# Altium schematic sheet YakupTrkn1.SchDoc
size A4
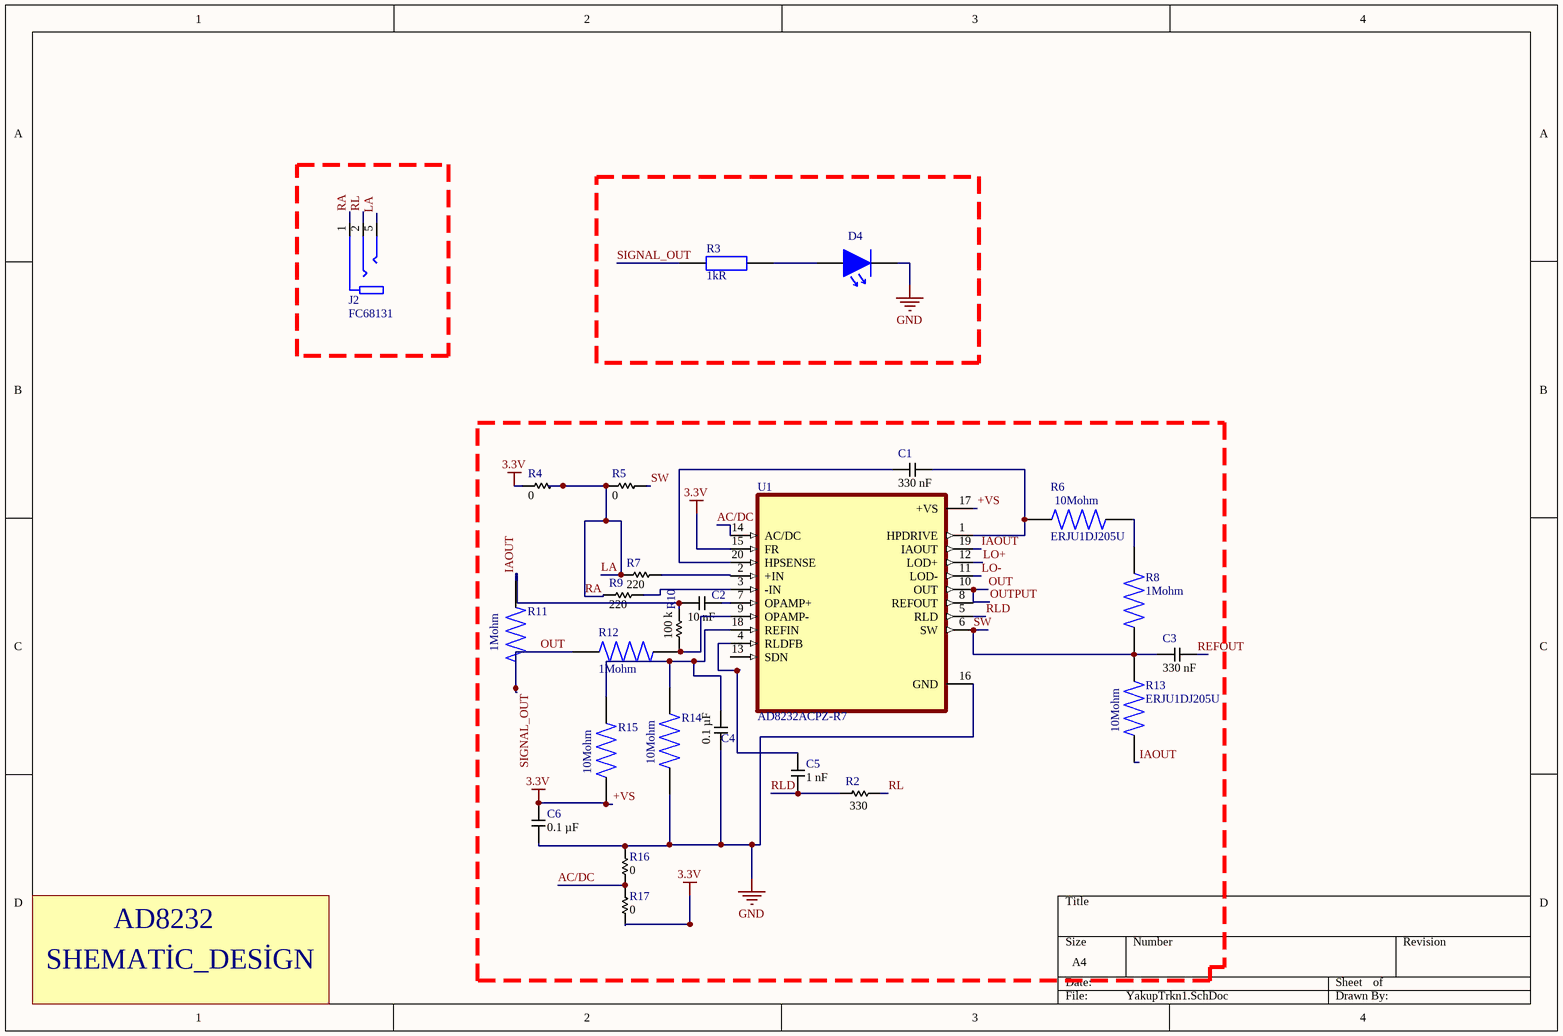
[diagram p0: YakupTrkn1.SchDoc]

## Parts
C1  Capacitance: 330 nF  [SAMSUNG_CAP_0805_095]  (hidden comment: CL21B334KOCNNNC)
C2  Capacitance: 10 nF  [SAMSUNG_CAP_0603_090]  (hidden comment: CL10B103KB8NNNL)
C3  Capacitance: 330 nF  [SAMSUNG_CAP_0805_095]  (hidden comment: CL21B334KOCNNNC)
C4  Capacitance: 0.1 µF  [SAMSUNG_CAP_0805_095]  (hidden comment: CL21B104MACNNNC)
C5  Capacitance: 1 nF  [SAMSUNG_CAP_0805_095]  (hidden comment: CL21B102KBCNNNC)
C6  Capacitance: 0.1 µF  [SAMSUNG_CAP_0805_095]  (hidden comment: CL21B104MACNNNC)
D4  LH R974-LP-1  [LED_RED_0805]  (value not drawn)
J2  FC68131  [CLIFF_FC68131]
R2  Resistance: 330  [ROYALOHM_RES_0805]  (hidden comment: 0805S8J0331T5E)
R3  Resistance: 1kR  [RES_0603]  (hidden comment: RC0603FR-0710KL)
R4  Resistance: 0  [ROYALOHM_RES_0603]  (hidden comment: 0603SAJ0000TDE)
R5  Resistance: 0  [ROYALOHM_RES_0603]  (hidden comment: 0603SAJ0000TDE)
R6  ERJU1DJ205U  [RES_ERJU1DJ205U]
R7  Resistance: 220  [ROYALOHM_RES_0603]  (hidden comment: 0603SAJ0221T5E)
R8  1Mohm  [RESC2012X65N]
R9  Resistance: 220  [ROYALOHM_RES_0603]  (hidden comment: 0603SAJ0221T5E)
R10  Resistance: 100 k  [ROYALOHM_RES_0805]  (hidden comment: 0805S8J0104T5E)
R11  1Mohm  [RESC2012X65N]
R12  1Mohm  [RESC2012X65N]
R13  ERJU1DJ205U  [RES_ERJU1DJ205U]
R14  (no value)  [RES_ERJU1DJ205U]
R15  (no value)  [RES_ERJU1DJ205U]
R16  Resistance: 0  [ROYALOHM_RES_0603]  (hidden comment: 0603SAJ0000TDE)
R17  Resistance: 0  [ROYALOHM_RES_0603]  (hidden comment: 0603SAJ0000TDE)
U1  AD8232ACPZ-R7  [QFN50P400X400X100-21N]

## Nets
+VS: C6.2 R4.1 R15.1 R17.1 U1.15(FR) U1.17(+VS)  [also labelled 3.3V]
GND: C4.2 C6.1 D4.1 R14.1 R16.2 U1.16(GND)
AC/DC: R16.1 R17.2 U1.14(AC/DC)
IAOUT: C2.1 R10.1 R11.1 R13.1 U1.19(IAOUT)
LA: J2.1(SLEEVE) J2.5(TIP) R4.2 R5.1 R7.1 R9.1  [also labelled RA]
LO+: U1.12(LOD+)
LO-: U1.11(LOD-)
OUT: R3.1 R11.2 R12.2 U1.10(OUT)  [also labelled OUTPUT, SIGNAL_OUT]
REFOUT: C3.2
RL: J2.2(RING) R2.2
RLD: C5.1 R2.1 U1.5(RLD)
SW: C3.1 R5.2 R8.2 R13.2 U1.6(SW)
NetC1_1: C1.1 U1.20(HPSENSE)
NetC1_2: C1.2 R6.1 U1.1(HPDRIVE)
NetC2_2: C2.2 U1.7(OPAMP+)
NetC4_1: C4.1 R14.2 R15.2 U1.18(REFIN)
NetC5_2: C5.2 U1.4(RLDFB)
NetD4_2: D4.2 R3.2
NetR6_2: R6.2 R8.1
NetR7_2: R7.2 U1.2(+IN)
NetR9_2: R9.2 U1.3(-IN)
NetR10_2: R10.2 R12.1 U1.9(OPAMP-)

Not connected (* = marked no-connect by the designer): U1 8(REFOUT) 13(SDN)

## Notes on the sheet
- SHEMATİC_DESİGN
- AD8232
- (in symbol ERJU1DJ205U) 10Mohm

## Library data of the parts
C1 C3 = CL21B334KOCNNNC: CAP CER 0.33UF 16V X7R 0805; Supplier 1: Digi-Key; Supplier 2: Mouser; Supplier 3: Arrow Electronics; Supplier Part Number 1: 1276-1797-1-ND; Supplier Part Number 2: 187-CL21B334KOCNNNC; Supplier Part Number 3: CL21B334KOCNNNC
C2 = CL10B103KB8NNNL: CAP CER 10000PF 50V X7R 0603; Supplier 1: Mouser; Supplier Part Number 1: 187-CL10B103KB8NNNL
C4 C6 = CL21B104MACNNNC: CAP CER 0.1UF 25V X7R 0805; Supplier 1: Digi-Key; Supplier 2: Mouser; Supplier 3: Arrow Electronics; Supplier Part Number 1: 1276-2449-1-ND; Supplier Part Number 2: 187-CL21B104MACNNNC; Supplier Part Number 3: CL21B104MACNNNC
C5 = CL21B102KBCNNNC: CAP CER 1000PF 50V X7R 0805; Supplier 1: Digi-Key; Supplier 2: Farnell; Supplier 3: Mouser; Supplier Part Number 1: 1276-2425-1-ND; Supplier Part Number 2: 3013468; Supplier Part Number 3: 187-CL21B102KBCNNNC
D4 = LED RED 0805: LED Uni-Color Hyper Red 660nm 2-Pin Chip 0805(2012Metric) T/R; Manufacturer: Osram Opto; Lens Color: White; Forward Voltage: 1.8V; Lens Style: Diffused,Flat,Colorless; Luminous Intensity: 71mcd; Viewing Angle: 160°; Forward Current: 30mA; Dominant Wavelength: 645nm; Number of Elements: 1; Test Current: 20mA; Reverse Voltage: 5V; Lens Transparency: Diffused; Luminous Flux: 0.17lm; Lens Size: 1.25mm; Designed by: BERK; Supplier 1: Digi-Key; Manufacturer Part Number: LH R974-LP-1; RoHS: Yes; Category: LEDs; Stock 1: 35632; Pricing 1: 1=0,26000, 10=0,13900, 100=0,06480, 500=0,05978, 1000=0,04683, 2000=0,04584 (USD); Mount: Surface Mount; Case/Package: 0805; Number of Pins: 2; Color: Red; Case Code (Imperial): 0805; Case Code (Metric): 2012; Min Operating Temperature: -30°C; Max Operating Temperature: 85°C; Packaging: Tape and Reel; Illumination Color: Red; Package Quantity: 1; Series: CHipLED; Length: 2.1mm; Width: 1.25mm; Depth: 1.35mm; Radiation Hardening: No; RoHS Compliant: Yes; ComponentLink1URL: http://www.jameco.com/Jameco/Products/ProdDS/2085634.pdf?src-supplier=Jameco; ComponentLink1Description: http://www.jameco.com/Jameco/Products/ProdDS/2085634.pdf?src-supplier=Jameco; ComponentLink2URL: http://components.arrow.com/part/dataview/0323_01825492?src-supplier=Arrow+Europe; ComponentLink2Description: http://components.arrow.com/part/dataview/0323_01825492?src-supplier=Arrow+Europe; ComponentLink3URL: https://dammedia.osram.info/media/resource/hires/osram-dam-2493888/LH%20R974.pdf?src-supplier=Digi-Key; ComponentLink3Description: https://dammedia.osram.info/media/resource/hires/osram-dam-2493888/LH%20R974.pdf?src-supplier=Digi-Key; ComponentLink4URL: http://www.mouser.com/ds/2/311/LH%20R974%20-%20CHIPLED%200805-318659.pdf?src-supplier=Mouser; ComponentLink4Description: http://www.mouser.com/ds/2/311/LH%20R974%20-%20CHIPLED%200805-318659.pdf?src-supplier=Mouser; ComponentLink5URL: https://www.verical.com/server-webapp/html/getDatasheet?partID=258950&src-supplier=Verical; ComponentLink5Description: https://www.verical.com/server-webapp/html/getDatasheet?partID=258950&src-supplier=Verical; ComponentLink6URL: http://components.arrow.com/part/dataview/41971690S1077610N9133?src-supplier=Arrow+Electronics; ComponentLink6Description: http://components.arrow.com/part/dataview/41971690S1077610N9133?src-supplier=Arrow+Electronics; ComponentLink7URL: http://components.arrow.com/part/dataview/41971690S6190115N2128?src-supplier=Arrow+Electronics; ComponentLink7Description: http://components.arrow.com/part/dataview/41971690S6190115N2128?src-supplier=Arrow+Electronics; Supplier Part Number 1: 475-1415-1-ND
J2 = FC68131: Stereo Jack, 3.5mm, 3pos, Pcb; MF: {'manufacturer': u'Cliff'}; Price: None; MP: FC68131; Availability: Unavailable; Package: None; Value: *
R2 = 0805S8J0331T5E: RES SMD 330R OHM 5% 1/8W 0805
R3 = RES 1K OHM 0603: RES 1K %1 OHM 0603 SMD; Manufacturer: Yageo; Manufacturer Part Number: RC0603JR-071KL; Designed by: BERK; Tolerance: 5%; Temperature Coefficient: 100ppm/°C; Voltage Rating (DC): 50V; Power Rating: 100mW; Body Length: 1.6mm; Supplier 1: Digi-Key; RoHS: Yes; Category: Chip SMD Resistors; Stock 1: 5112056; Pricing 1: 1=0,10000, 10=0,01900, 100=0,00770, 1000=0,00344, 2500=0,00298 (USD); Case/Package: 0603; Number of Pins: 2; Contact Plating: Tin,Matte; Case Code (Imperial): 0603; Case Code (Metric): 1608; Size Code: 0603; Min Operating Temperature: -55°C; Max Operating Temperature: 155°C; Resistor Type: Thick Film; Packaging: Tape and Reel; Package Quantity: 5000; Voltage Rating: 50V; Termination: SMD/SMT; Series: RC; Resistance Tolerance: 5%; Construction: Rectangular; Length: 1.6mm; Width: 0.8mm; Height: 0.45mm; Depth: 0.8mm; Radiation Hardening: No; REACH SVHC: Unknown; Lead Free: Lead Free; Military Standard: Not; RoHS Compliant: Yes; ComponentLink1URL: https://datasheet.ciiva.com/8883/pyu-rc0603-51-rohs-l-4-8883051.pdf?src-supplier=Avnet; ComponentLink1Description: https://datasheet.ciiva.com/8883/pyu-rc0603-51-rohs-l-4-8883051.pdf?src-supplier=Avnet; ComponentLink2URL: https://datasheet.ciiva.com/7746/443971-7746461.pdf?src-supplier=Element14; ComponentLink2Description: https://datasheet.ciiva.com/7746/443971-7746461.pdf?src-supplier=Element14; ComponentLink3URL: https://datasheet.ciiva.com/22747/443971-22747533.pdf?src-supplier=Element14; ComponentLink3Description: https://datasheet.ciiva.com/22747/443971-22747533.pdf?src-supplier=Element14; ComponentLink4URL: https://datasheet.ciiva.com/7746/443971-7746462.pdf?src-supplier=Element14; ComponentLink4Description: https://datasheet.ciiva.com/7746/443971-7746462.pdf?src-supplier=Element14; Supplier Part Number 1: 311-1.0KGRCT-ND
R4 R5 R16 R17 = 0603SAJ0000TDE: RES SMD 0 OHM 5% 1/10W 0603
R6 R13-R15 = ERJU1DJ205U: MF: {'manufacturer': u'Panasonic'}; Package: None; Price: None; Availability: Unavailable; MP: ERJU1DJ205U; Value: *
R7 R9 = 0603SAJ0221T5E: RES SMD 220R OHM 5% 1/10W 0603
R8 R11 R12 = RNCS0805BKE1M00: MF: {'manufacturer': u'Stackpole Electronics Inc'}; MP: RNCS0805BKE1M00; Availability: Unavailable; Package: None; Value: *; Price: None
R10 = 0805S8J0104T5E: RES SMD 100K OHM 5% 1/8W 0805
U1 = AD8232ACPZ-R7: MF: {'manufacturer': u'Analog Devices'}; Availability: Unavailable; Price: None; MP: AD8232ACPZ-R7; Package: None; Value: *